# Altium schematic sheet 3_NET.schdoc.schdoc
size 431 x 309 mm; Symbol: Sheet-Symbol_A3; Device: Sheet-Symbol_A3; Company: 嘉立创EDA; Version: V1.0; Page Size: A3; @Project Name: V3S_LCD; @Page Count: 4; @Update Date: 2023-12-17; @Create Date: 2023-12-16; @Schematic Name: Schematic1; @Page No: 3; @Page Name: NET
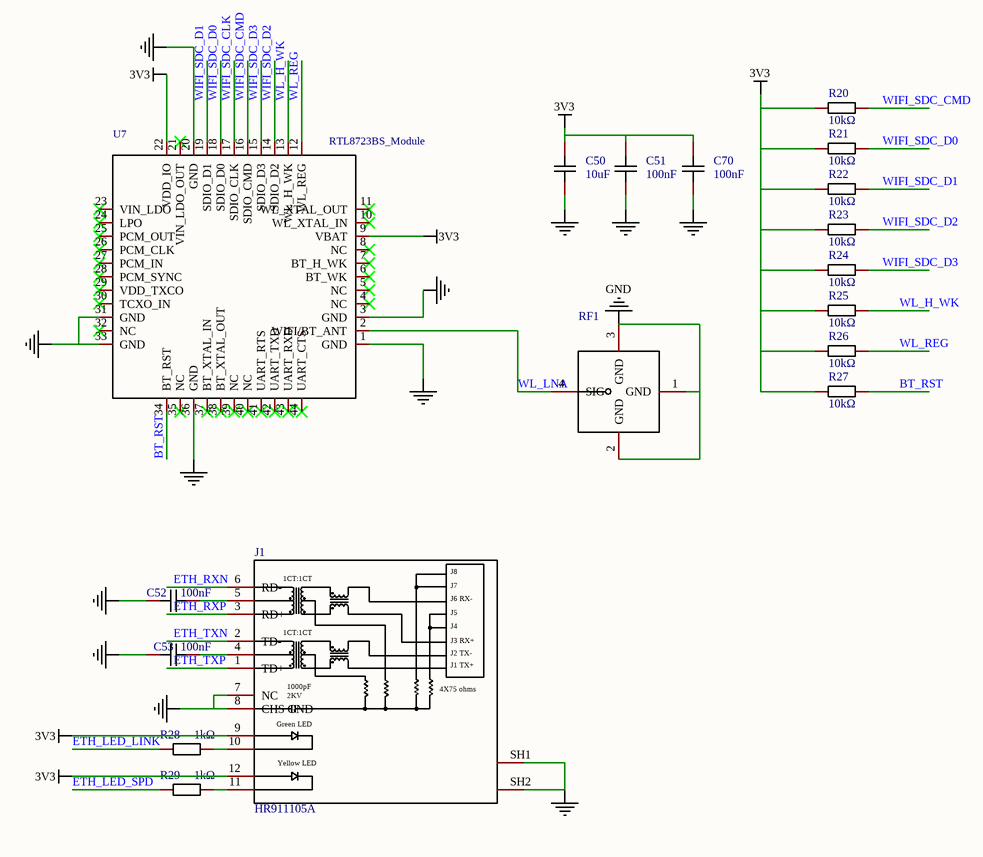
[diagram p0: 3_NET.schdoc.schdoc]

## Parts
C50  10uF  [C0603]
C51  100nF  [C0603]
C52  100nF  [C0603]
C53  100nF  [C0603]
C70  100nF  [C0603]
J1  HR911105A  [RJ45-TH_HR911105A]
R20  10kΩ  [R0603]
R21  10kΩ  [R0603]
R22  10kΩ  [R0603]
R23  10kΩ  [R0603]
R24  10kΩ  [R0603]
R25  10kΩ  [R0603]
R26  10kΩ  [R0603]
R27  10kΩ  [R0603]
R28  1kΩ  [R0603]
R29  1kΩ  [R0603]
RF1  KH-IPEX-K501-29  [ANT-SMD_KH-IPEX-K501-29]  (value not drawn)
U7  RTL8723BS_Module  [R8723BS]

## Nets
3V3: C50.2 C51.2 C70.2 J1.9 J1.12 R20.2 R21.2 R22.2 R23.2 R24.2 R25.2 R26.2 R27.2 U7.9(VBAT) U7.22(VDD_IO)
GND: RF1.1(GND) RF1.2(GND) RF1.3(GND)
NetC50_1: C50.1 C51.1 C52.1 C53.1 C70.1 J1.7(NC) J1.8(CHS_GND) J1.SH1 J1.SH2 U7.1(GND) U7.3(GND) U7.20(GND) U7.31(GND) U7.33(GND) U7.36(GND)
BT_RST: R27.1 U7.34(BT_RST)
ETH_LED_LINK: R28.1
ETH_LED_SPD: R29.1
ETH_RXN: J1.6(RD-)
ETH_RXP: J1.3(RD+)
ETH_TXN: J1.2(TD-)
ETH_TXP: J1.1(TD+)
WIFI_SDC_CLK: U7.17(SDIO_CLK)
WIFI_SDC_CMD: R20.1 U7.16(SDIO_CMD)
WIFI_SDC_D0: R21.1 U7.18(SDIO_D0)
WIFI_SDC_D1: R22.1 U7.19(SDIO_D1)
WIFI_SDC_D2: R23.1 U7.14(SDIO_D2)
WIFI_SDC_D3: R24.1 U7.15(SDIO_D3)
WL_H_WK: R25.1 U7.13(WL_H_WK)
WL_LNA: RF1.4(SIG) U7.2(WIFI/BT_ANT)
WL_REG: R26.1 U7.12(WL_REG)
NetC52_2: C52.2 J1.5
NetC53_2: C53.2 J1.4
NetJ1_10: J1.10 R28.2
NetJ1_11: J1.11 R29.2

Not connected (* = marked no-connect by the designer): U7 4(NC)* 5(NC)* 6(BT_WK)* 7(BT_H_WK)* 8(NC)* 10(WL_XTAL_IN)* 11(WL_XTAL_OUT)* 21(VIN_LDO_OUT)* 23(VIN_LDO)* 24(LPO)* 25(PCM_OUT)* 26(PCM_CLK)* 27(PCM_IN)* 28(PCM_SYNC)* 29(VDD_TXCO)* 30(TCXO_IN)* 32(NC)* 35(NC)* 37(BT_XTAL_IN)* 38(BT_XTAL_OUT)* 39(NC)* 40(NC)* 41(UART_RTS)* 42(UART_TXD)* 43(UART_RXD)* 44(UART_CTS)*

## Notes on the sheet
- 1
- 2
- 3
- 4
- 5
- 6
- A
- B
- C
- 原理图
- Schematic1
- 创建日期
- 更新日期
- 2023-12-17
- 2023-12-16
- D
- 审阅
- 绘制
- 图页
- NET
- 物料编码
- V3S_LCD
- 版本
- 尺寸
- 页
- 共
- V1.0
- A3
- 嘉立创EDA
- (in symbol HR911105A_C12074) J8; 1CT:1CT; J7; J6 RX-; J5; J4; J3 RX+; J2 TX-; J1 TX+; 1000pF; 4X75 ohms; 2KV; Green LED; Yellow LED

## Library data of the parts
C50 = CL10A106KP8NNNC: Manufacturer: SAMSUNG(三星); Add into BOM: yes; Tolerance: ±10%; Voltage Rated: 10V; Temperature Coefficient: X5R; Description: 容值:10uF;精度:±10%;额定电压:10V;材质(温度系数):X5R;; Name: 10uF; Symbol: CL10A106KP8NNNC; Device: CL10A106KP8NNNC; Supplier: LCSC; Manufacturer Part: CL10A106KP8NNNC; Value: 10uF; Supplier Part: C19702; JLCPCB Part Class: 基础库; LCSC Part Name: 10uF ±10% 10V; Supplier Footprint: 0603; Datasheet: https://atta.szlcsc.com/upload/public/pdf/source/20160218/1457707763339.pdf; Convert to PCB: yes
C51-C53 C70 = CC0603KRX7R9BB104: Manufacturer: YAGEO(国巨); Add into BOM: yes; Tolerance: ±10%; Voltage Rated: 50V; Temperature Coefficient: X7R; Description: 容值:100nF;精度:±10%;额定电压:50V;材质(温度系数):X7R;; Name: 100nF; Symbol: CC0603KRX7R9BB104; Device: CC0603KRX7R9BB104; Supplier: LCSC; Manufacturer Part: CC0603KRX7R9BB104; Value: 100nF; Supplier Part: C14663; JLCPCB Part Class: Basic Part; LCSC Part Name: 100nF ±10% 50V; Supplier Footprint: 0603; Datasheet: https://atta.szlcsc.com/upload/public/pdf/source/20180910/C282072_33301C7F631E79921B82A8DAC6BCC5B3.pdf; Convert to PCB: yes
J1 = HR911105A_C12074: Manufacturer: HANRUN(汉仁); Add into BOM: yes; Connector Type: RJ插座; USOC Codes: RJ45; Number of Ports: 1; LED: 带LED; Description: 连接器类型:RJ插座;USOC代码:RJ45;端口数量:1;等级:-;屏蔽:-;LED:带LED;; Name: HR911105A; Symbol: HR911105A_C12074; Device: HR911105A_C12074; Supplier: LCSC; Manufacturer Part: HR911105A; Supplier Part: C12074; JLCPCB Part Class: 扩展库; LCSC Part Name: RJ45 带LED 带LED灯; Supplier Footprint: 插件; Datasheet: https://atta.szlcsc.com/upload/public/pdf/source/20170918/C12074_1505726819496976146.pdf; Convert to PCB: yes; Ratings: -; Shielding: -
R20-R27 = 0603WAF1002T5E: Manufacturer: UNI-ROYAL(厚声); Add into BOM: yes; Tolerance: ±1%; Power(Watts): 100mW; Overload Voltage (Max): 75V; Temperature Coefficient: ±100ppm/℃; Description: 阻值:10kΩ;精度:±1%;功率:100mW;温度系数:±100ppm/℃;电阻类型:厚膜电阻;; Name: 10kΩ; Symbol: 0603WAF1002T5E; Device: 0603WAF1002T5E; Supplier: LCSC; Manufacturer Part: 0603WAF1002T5E; Supplier Part: C25804; Value: 10kΩ; JLCPCB Part Class: Basic Part; LCSC Part Name: 10kΩ ±1% 100mW 厚膜电阻; Supplier Footprint: 0603; Datasheet: https://atta.szlcsc.com/upload/public/pdf/source/20200306/C422600_1E6D84923E4A46A82E41ADD87F860B5C.pdf; Convert to PCB: yes; Type: 厚膜电阻; Operating Temperature Range: -55℃~+155℃
R28 R29 = 0603WAF1001T5E: Manufacturer: UNI-ROYAL(厚声); Add into BOM: yes; Tolerance: ±1%; Power(Watts): 100mW; Temperature Coefficient: ±100ppm/℃; Overload Voltage (Max): 75V; Description: 电阻类型:厚膜电阻;阻值:1kΩ;精度:±1%;功率:100mW;温度系数:±100ppm/℃;; Name: 1kΩ; Symbol: 0603WAF1001T5E; Device: 0603WAF1001T5E; Supplier: LCSC; Manufacturer Part: 0603WAF1001T5E; Supplier Part: C21190; Value: 1kΩ; JLCPCB Part Class: 基础库; LCSC Part Name: 厚膜电阻 1kΩ ±1% 100mW; Supplier Footprint: 0603; Datasheet: https://atta.szlcsc.com/upload/public/pdf/source/20200306/C422600_1E6D84923E4A46A82E41ADD87F860B5C.pdf; Convert to PCB: yes; Type: 厚膜电阻; Operating Temperature Range: -55℃~+155℃
RF1 = KH-IPEX-K501-29: 连接器类型:板端;射频系列:IPEX;接口类型:内针;端口数量:1;阻抗:50Ω;频率-最大值:3GHz;样式:-;接口直径:2mm;接口长度/高度:1.25mm;工作温度范围:-40~+90;; Manufacturer: kinghelm(金航标); Add into BOM: yes; Connector Type: 板端; RF Series: IPEX; Interface Type: 内针; Number of Ports: 1; Impedance: 50Ω; Frequency-Max: 3GHz; Interface Diameter: 2mm; Interface Length/Height: 1.25mm; Symbol: KH-IPEX-K501-29; Device: KH-IPEX-K501-29; Supplier: LCSC; Supplier Part: C411563; Manufacturer Part: KH-IPEX-K501-29; JLCPCB Part Class: Extended Part; LCSC Part Name: IPEX 内针 1代; Supplier Footprint: SMD; Datasheet: https://atta.szlcsc.com/upload/public/pdf/source/20220620/3534C43453AFDE5147CC743E04DB9A56.pdf; Convert to PCB: yes; Style: -; Operating Temperature Range: -40~+90
U7 = R8723BS: Add into BOM: yes; Name: RTL8723BS_Module; Symbol: RTL8723BS_Module; Device: R8723BS; Convert to PCB: yes; Origin Footprint: R8723BS